# Altium schematic sheet Circle.SchDoc
size A4
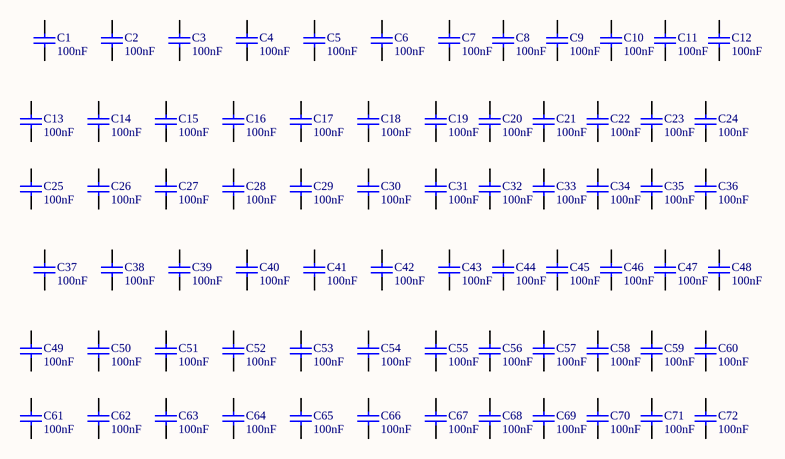
[diagram p0: Circle.SchDoc]

## Parts
C1  100nF  [CAP-0402-ROT]
C2  100nF  [CAP-0402-ROT]
C3  100nF  [CAP-0402-ROT]
C4  100nF  [CAP-0402-ROT]
C5  100nF  [CAP-0402-ROT]
C6  100nF  [CAP-0402-ROT]
C7  100nF  [CAP-0402-ROT]
C8  100nF  [CAP-0402-ROT]
C9  100nF  [CAP-0402-ROT]
C10  100nF  [CAP-0402-ROT]
C11  100nF  [CAP-0402-ROT]
C12  100nF  [CAP-0402-ROT]
C13  100nF  [CAP-0402-ROT]
C14  100nF  [CAP-0402-ROT]
C15  100nF  [CAP-0402-ROT]
C16  100nF  [CAP-0402-ROT]
C17  100nF  [CAP-0402-ROT]
C18  100nF  [CAP-0402-ROT]
C19  100nF  [CAP-0402-ROT]
C20  100nF  [CAP-0402-ROT]
C21  100nF  [CAP-0402-ROT]
C22  100nF  [CAP-0402-ROT]
C23  100nF  [CAP-0402-ROT]
C24  100nF  [CAP-0402-ROT]
C25  100nF  [CAP-0402-ROT]
C26  100nF  [CAP-0402-ROT]
C27  100nF  [CAP-0402-ROT]
C28  100nF  [CAP-0402-ROT]
C29  100nF  [CAP-0402-ROT]
C30  100nF  [CAP-0402-ROT]
C31  100nF  [CAP-0402-ROT]
C32  100nF  [CAP-0402-ROT]
C33  100nF  [CAP-0402-ROT]
C34  100nF  [CAP-0402-ROT]
C35  100nF  [CAP-0402-ROT]
C36  100nF  [CAP-0402-ROT]
C37  100nF  [CAP-0402-ROT]
C38  100nF  [CAP-0402-ROT]
C39  100nF  [CAP-0402-ROT]
C40  100nF  [CAP-0402-ROT]
C41  100nF  [CAP-0402-ROT]
C42  100nF  [CAP-0402-ROT]
C43  100nF  [CAP-0402-ROT]
C44  100nF  [CAP-0402-ROT]
C45  100nF  [CAP-0402-ROT]
C46  100nF  [CAP-0402-ROT]
C47  100nF  [CAP-0402-ROT]
C48  100nF  [CAP-0402-ROT]
C49  100nF  [CAP-0402-ROT]
C50  100nF  [CAP-0402-ROT]
C51  100nF  [CAP-0402-ROT]
C52  100nF  [CAP-0402-ROT]
C53  100nF  [CAP-0402-ROT]
C54  100nF  [CAP-0402-ROT]
C55  100nF  [CAP-0402-ROT]
C56  100nF  [CAP-0402-ROT]
C57  100nF  [CAP-0402-ROT]
C58  100nF  [CAP-0402-ROT]
C59  100nF  [CAP-0402-ROT]
C60  100nF  [CAP-0402-ROT]
C61  100nF  [CAP-0402-ROT]
C62  100nF  [CAP-0402-ROT]
C63  100nF  [CAP-0402-ROT]
C64  100nF  [CAP-0402-ROT]
C65  100nF  [CAP-0402-ROT]
C66  100nF  [CAP-0402-ROT]
C67  100nF  [CAP-0402-ROT]
C68  100nF  [CAP-0402-ROT]
C69  100nF  [CAP-0402-ROT]
C70  100nF  [CAP-0402-ROT]
C71  100nF  [CAP-0402-ROT]
C72  100nF  [CAP-0402-ROT]

## Nets

Not connected (* = marked no-connect by the designer): C1 1 2; C2 1 2; C3 1 2; C4 1 2; C5 1 2; C6 1 2; C7 1 2; C8 1 2; C9 1 2; C10 1 2; C11 1 2; C12 1 2; C13 1 2; C14 1 2; C15 1 2; C16 1 2; C17 1 2; C18 1 2; C19 1 2; C20 1 2; C21 1 2; C22 1 2; C23 1 2; C24 1 2; C25 1 2; C26 1 2; C27 1 2; C28 1 2; C29 1 2; C30 1 2; C31 1 2; C32 1 2; C33 1 2; C34 1 2; C35 1 2; C36 1 2; C37 1 2; C38 1 2; C39 1 2; C40 1 2; C41 1 2; C42 1 2; C43 1 2; C44 1 2; C45 1 2; C46 1 2; C47 1 2; C48 1 2; C49 1 2; C50 1 2; C51 1 2; C52 1 2; C53 1 2; C54 1 2; C55 1 2; C56 1 2; C57 1 2; C58 1 2; C59 1 2; C60 1 2; C61 1 2; C62 1 2; C63 1 2; C64 1 2; C65 1 2; C66 1 2; C67 1 2; C68 1 2; C69 1 2; C70 1 2; C71 1 2; C72 1 2

## Library data of the parts
C1-C72 = Cap: Capacitor; Published: 8-Jun-2000; LatestRevisionDate: 17-Jul-2002; LatestRevisionNote: Re-released for DXP Platform.; PackageReference: RAD-0.3; Publisher: Altium Limited; PackageDescription: Radial Cap, Thru-Hole; 2 Leads; 0.3 in Pin Spacing; Value: 100nF